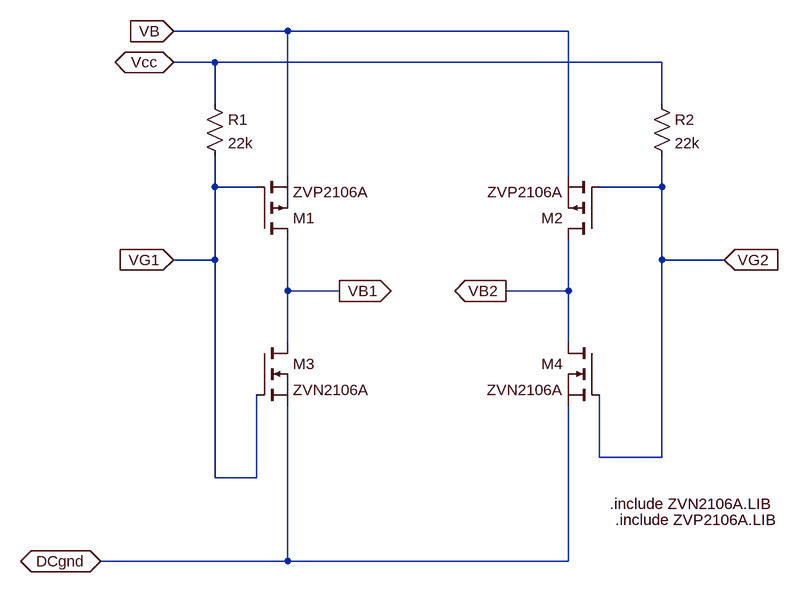
[diagram p0: schematic Motor_direction.asc]
Motor_direction.asc, the LTspice schematic file:
Version 4
SHEET 1 1016 952
WIRE 240 64 64 64
WIRE 672 64 240 64
WIRE 128 112 64 112
WIRE 816 112 128 112
WIRE 128 176 128 112
WIRE 816 176 816 112
WIRE 240 288 240 64
WIRE 672 288 672 64
WIRE 128 304 128 256
WIRE 192 304 128 304
WIRE 816 304 816 256
WIRE 816 304 720 304
WIRE 128 416 128 304
WIRE 128 416 64 416
WIRE 816 416 816 304
WIRE 912 416 816 416
WIRE 240 464 240 384
WIRE 320 464 240 464
WIRE 672 464 672 384
WIRE 672 464 576 464
WIRE 240 544 240 464
WIRE 672 544 672 464
WIRE 720 720 720 624
WIRE 816 720 816 416
WIRE 816 720 720 720
WIRE 128 752 128 416
WIRE 192 752 192 624
WIRE 192 752 128 752
WIRE 240 880 240 640
WIRE 240 880 -48 880
WIRE 672 880 672 640
WIRE 672 880 240 880
FLAG 64 64 VB
IOPIN 64 64 In
FLAG 64 112 Vcc
IOPIN 64 112 BiDir
FLAG -48 880 DCgnd
IOPIN -48 880 BiDir
FLAG 64 416 VG1
IOPIN 64 416 In
FLAG 912 416 VG2
IOPIN 912 416 In
FLAG 320 464 VB1
IOPIN 320 464 Out
FLAG 576 464 VB2
IOPIN 576 464 Out
SYMBOL res 112 160 R0
SYMATTR InstName R1
SYMATTR Value 22k
SYMBOL pmos 720 384 R180
SYMATTR InstName M2
SYMATTR Value ZVP2106A
SYMBOL pmos 192 384 M180
SYMATTR InstName M1
SYMATTR Value ZVP2106A
SYMBOL nmos 192 544 R0
SYMATTR InstName M3
SYMATTR Value ZVN2106A
SYMBOL nmos 720 544 M0
SYMATTR InstName M4
SYMATTR Value ZVN2106A
SYMBOL res 800 160 R0
SYMATTR InstName R2
SYMATTR Value 22k
TEXT 736 792 Left 2 !.include ZVN2106A.LIB
TEXT 744 816 Left 2 !.include ZVP2106A.LIB

The netlist it stands for:
* Motor_direction.asc
R1 Vcc VG1 22k
M2 VB2 VG2 VB VB ZVP2106A
M1 VB1 VG1 VB VB ZVP2106A
M3 VB1 VG1 DCgnd DCgnd ZVN2106A
M4 VB2 VG2 DCgnd DCgnd ZVN2106A
R2 Vcc VG2 22k
.model NMOS NMOS
.model PMOS PMOS
.lib standard.mos
.include ZVN2106A.LIB
.include ZVP2106A.LIB
.backanno
.end